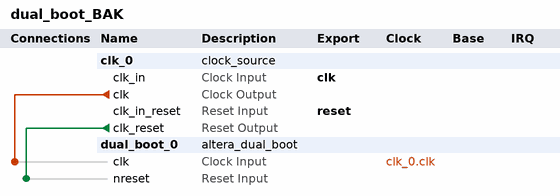
[diagram p0: system contents]
# Platform Designer (Qsys) system dual_boot_BAK, MAX 10 10M50DAF484C6GES
# Parameters at their usual value, and those the tool derives, are not listed.
package require -exact qsys 14.1
create_system dual_boot_BAK
set_project_property DEVICE_FAMILY {MAX 10}
set_project_property DEVICE 10M50DAF484C6GES

add_instance clk_0 clock_source 14.1
set_instance_parameter_value clk_0 clockFrequency 50000000

add_instance dual_boot_0 altera_dual_boot 14.1
set_instance_parameter_value dual_boot_0 CLOCK_FREQUENCY 80.0

# connections
add_connection clk_0.clk dual_boot_0.clk clock
add_connection clk_0.clk_reset dual_boot_0.nreset reset

# exported interfaces
add_interface clk clock sink
set_interface_property clk EXPORT_OF clk_0.clk_in
add_interface reset reset sink
set_interface_property reset EXPORT_OF clk_0.clk_in_reset

set_interconnect_requirement {$system} qsys_mm.clockCrossingAdapter HANDSHAKE
set_interconnect_requirement {$system} qsys_mm.insertDefaultSlave FALSE
set_interconnect_requirement {$system} qsys_mm.maxAdditionalLatency 1

save_system dual_boot_BAK.qsys
